# Altium project Senior_Project_PCB.PrjPcb
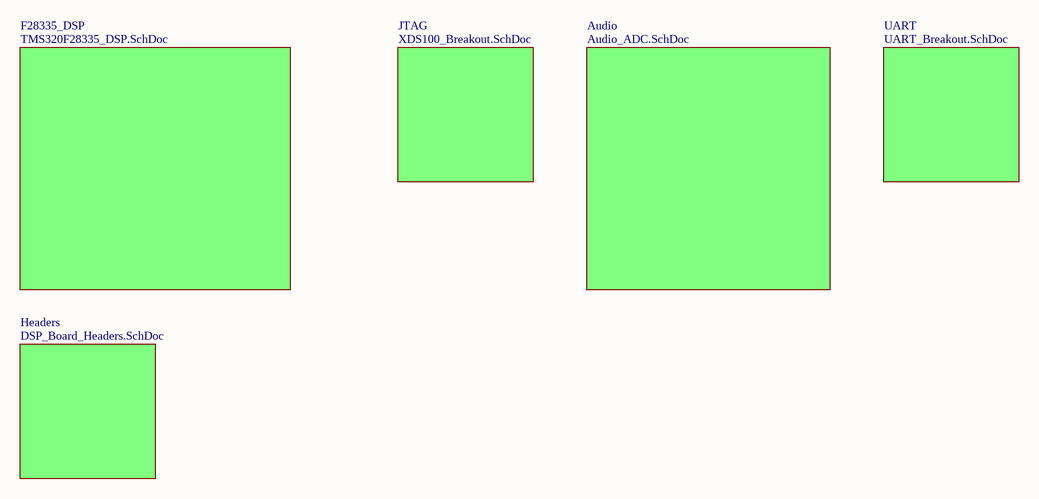
[diagram p0: DSP_Board.SchDoc]
5 sheets, 124 parts. Net scope: global (net labels, ports and power ports of the same name join across sheets).
Board file: DSP_Board.PcbDoc
Sheets:
  DSP_Board.SchDoc
    F28335_DSP = TMS320F28335_DSP.SchDoc
    Audio = Audio_ADC.SchDoc
    Headers = DSP_Board_Headers.SchDoc
  DSP_Power.SchDoc

## Sheet DSP_Board.SchDoc
size Letter

### Sub-sheets
Audio = Audio_ADC.SchDoc: no entries
F28335_DSP = TMS320F28335_DSP.SchDoc: no entries
Headers = DSP_Board_Headers.SchDoc: no entries
JTAG = XDS100_Breakout.SchDoc (file not in this document): no entries
UART = UART_Breakout.SchDoc (file not in this document): no entries

## Sheet TMS320F28335_DSP.SchDoc
size C
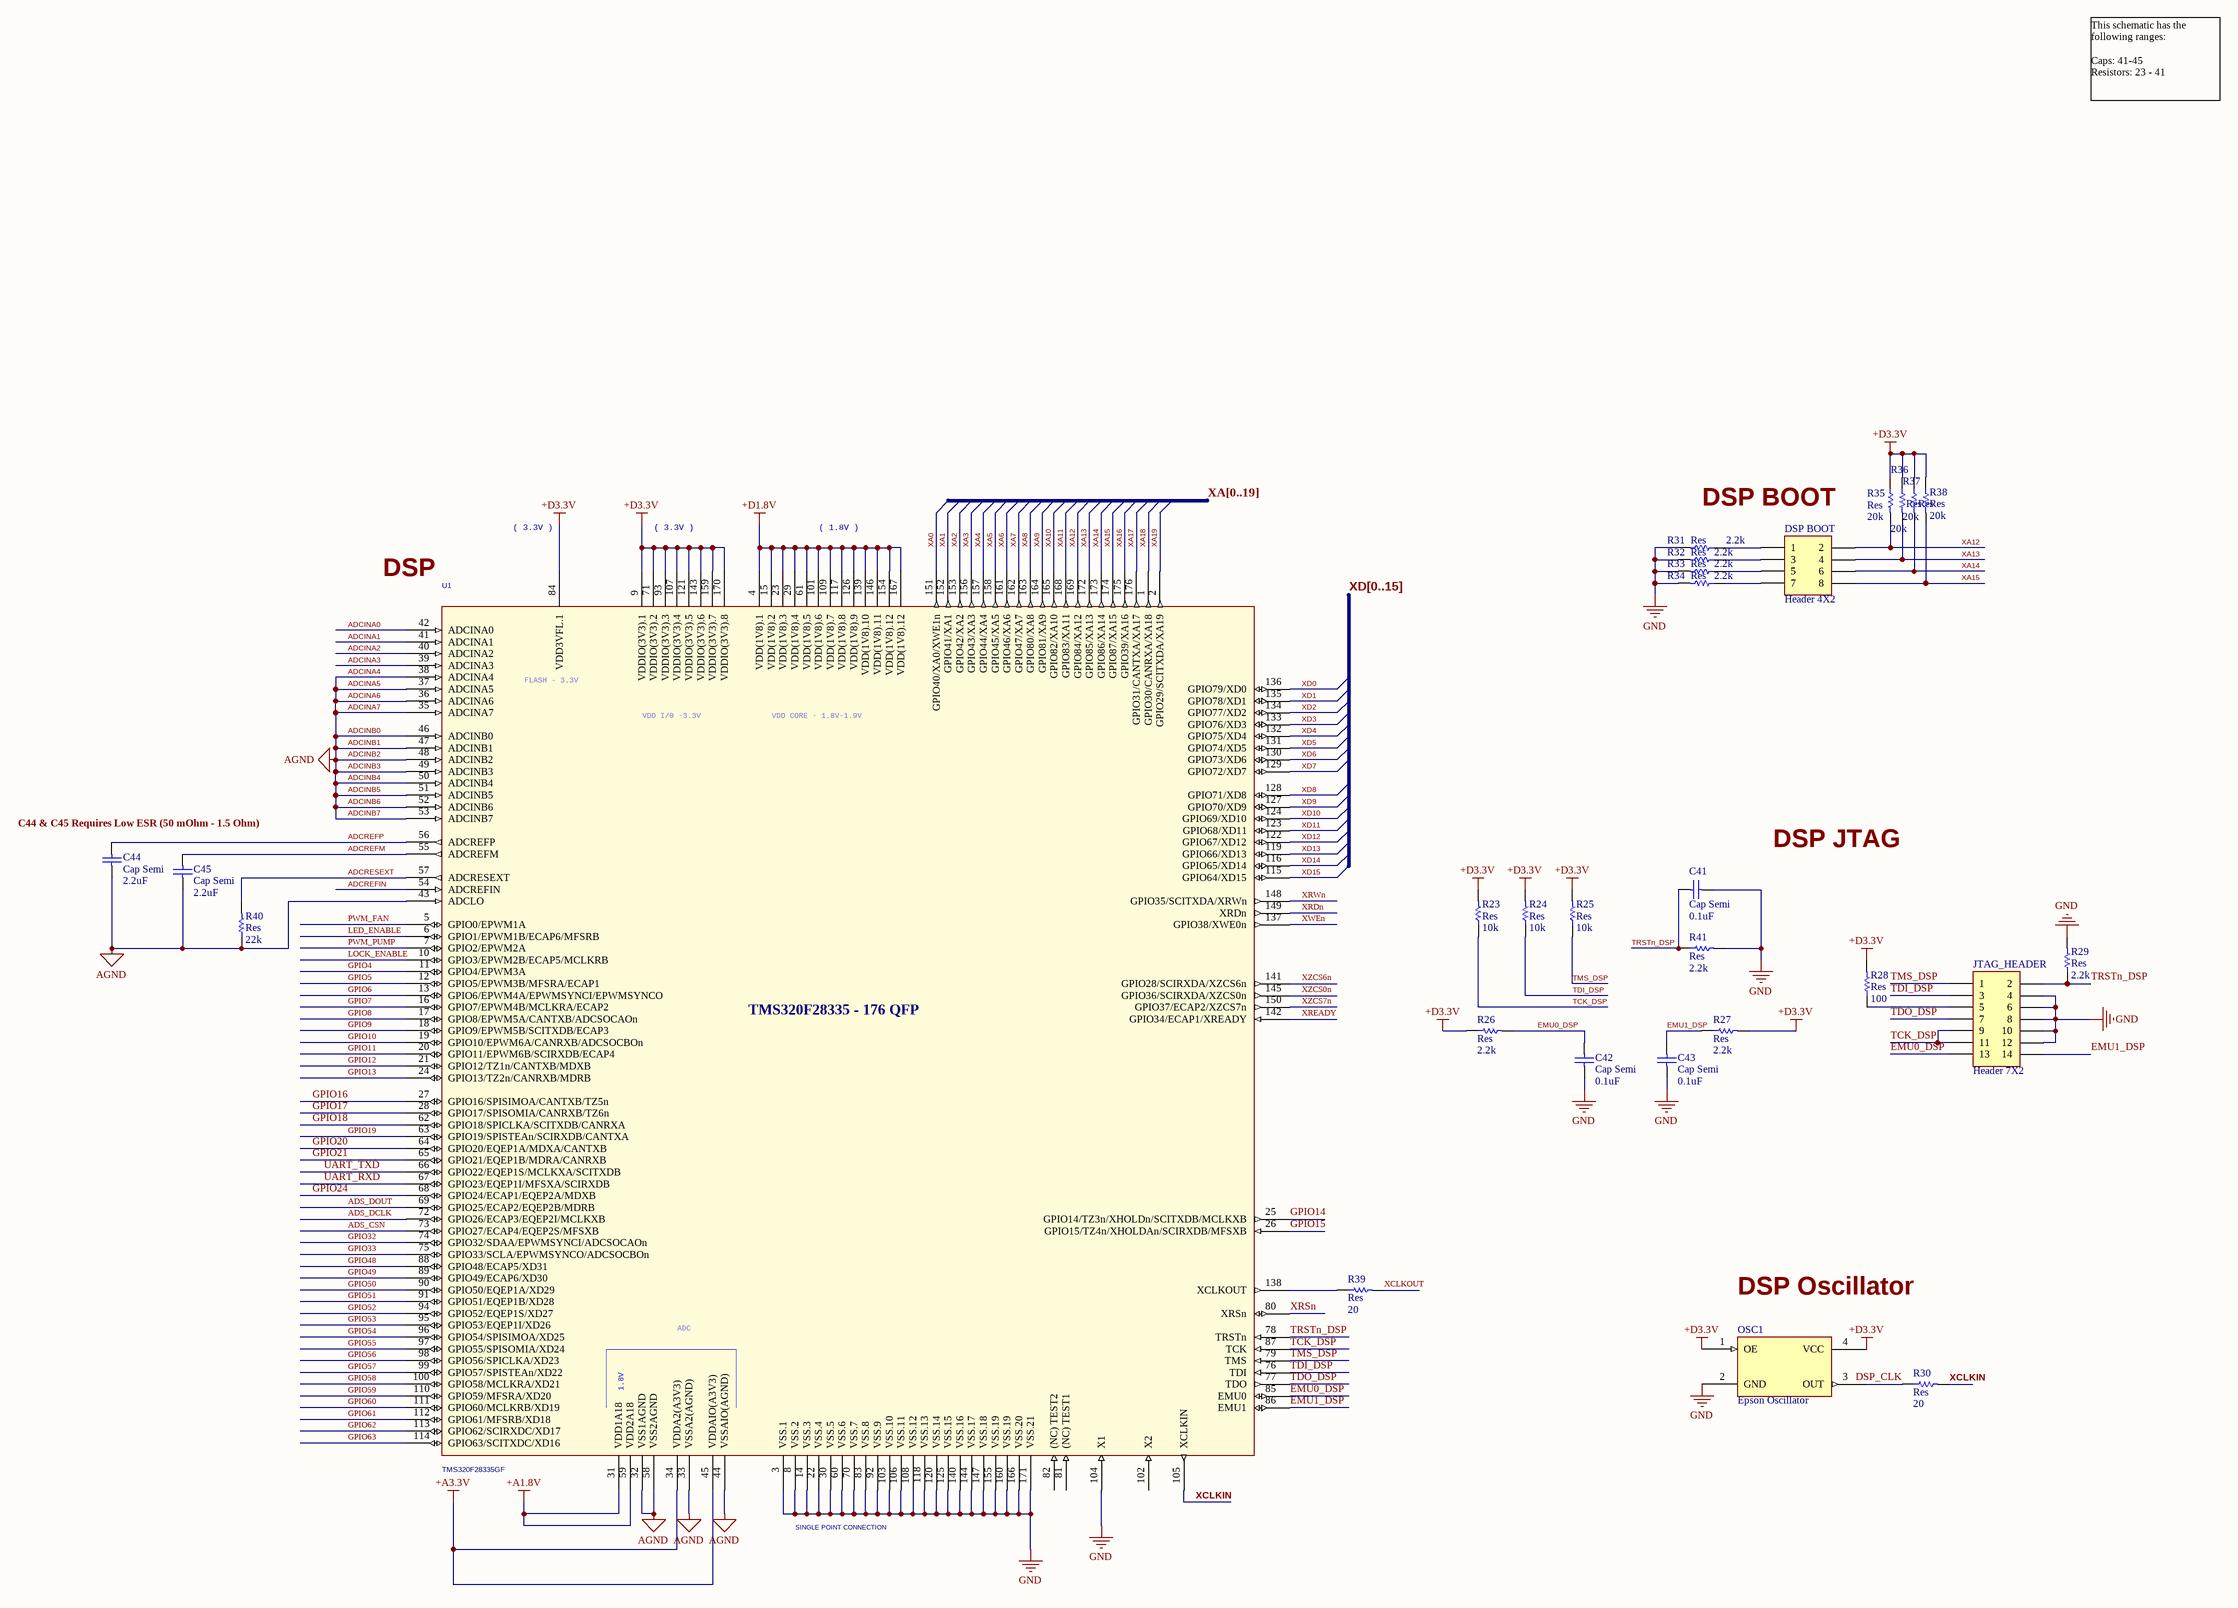
[diagram p1: TMS320F28335_DSP.SchDoc]

### Parts
C41  Cap Semi  value 0.1uF  [0805]
C42  Cap Semi  value 0.1uF  [0805]
C43  Cap Semi  value 0.1uF  [0805]
C44  Cap Semi  value 2.2uF  [0805]
C45  Cap Semi  value 2.2uF  [0805]
DSP_BOOT  Header 4X2  [HDR2X4]
JTAG_HEADER  Header 7X2  [HDR2X7]
OSC1  Epson Oscillator  [Oscillator]
R23  Res  value 10k  [0805]
R24  Res  value 10k  [0805]
R25  Res  value 10k  [0805]
R26  Res  value 2.2k  [0805]
R27  Res  value 2.2k  [0805]
R28  Res  value 100  [0805]
R29  Res  value 2.2k  [0805]
R30  Res  value 20  [0805]
R31  Res  value 2.2k  [0805]
R32  Res  value 2.2k  [0805]
R33  Res  value 2.2k  [0805]
R34  Res  value 2.2k  [0805]
R35  Res  value 20k  [0805]
R36  Res  value 20k  [0805]
R37  Res  value 20k  [0805]
R38  Res  value 20k  [0805]
R39  Res  value 20  [0805]
R40  Res  value 22k  [0805]
R41  Res  value 2.2k  [0805]
U1  TMS320F28335GF  [QFP176]

### Nets
+A1.8V: U1.31(VDD1A18) U1.59(VDD2A18)
+A3.3V: U1.34(VDDA2(A3V3)) U1.45(VDDAIO(A3V3))
+D1.8V: U1.4(VDD(1V8).1) U1.15(VDD(1V8).2) U1.23(VDD(1V8).3) U1.29(VDD(1V8).4) U1.61(VDD(1V8).5) U1.101(VDD(1V8).6) U1.109(VDD(1V8).7) U1.117(VDD(1V8).8) U1.126(VDD(1V8).9) U1.139(VDD(1V8).10) U1.146(VDD(1V8).11) U1.154(VDD(1V8).12) U1.167(VDD(1V8).12)
+D3.3V: OSC1.1(OE) OSC1.4(VCC) R23.2 R24.2 R25.2 R26.1 R27.2 R28.2 R35.1 R36.1 R37.1 R38.1 U1.9(VDDIO(3V3).1) U1.71(VDDIO(3V3).2) U1.84(VDD3VFL.1) U1.93(VDDIO(3V3).3) U1.107(VDDIO(3V3).4) U1.121(VDDIO(3V3).5) U1.143(VDDIO(3V3).6) U1.159(VDDIO(3V3).7) U1.170(VDDIO(3V3).8)
ADCINA4: C44.2 C45.2 R40.1 U1.32(VSS1AGND) U1.33(VSSA2(AGND)) U1.35(ADCINA7) U1.36(ADCINA6) U1.37(ADCINA5) U1.38(ADCINA4) U1.43(ADCLO) U1.44(VSSAIO(AGND)) U1.46(ADCINB0) U1.47(ADCINB1) U1.48(ADCINB2) U1.49(ADCINB3) U1.50(ADCINB4) U1.51(ADCINB5) U1.52(ADCINB6) U1.53(ADCINB7) U1.58(VSS2AGND)  [also labelled ADCINA5, ADCINA6, ADCINA7, ADCINB0, ADCINB1, ADCINB2, ADCINB3, ADCINB4, ADCINB5, ADCINB6, ADCINB7, AGND]
GND: C41.1 C42.1 C43.1 JTAG_HEADER.4 JTAG_HEADER.6 JTAG_HEADER.8 JTAG_HEADER.10 JTAG_HEADER.12 OSC1.2(GND) R29.2 R31.2 R32.2 R33.2 R34.2 R41.2 U1.3(VSS.1) U1.8(VSS.2) U1.14(VSS.3) U1.22(VSS.4) U1.30(VSS.5) U1.60(VSS.6) U1.70(VSS.7) U1.83(VSS.8) U1.92(VSS.9) U1.103(VSS.10) U1.104(X1) U1.106(VSS.11) U1.108(VSS.12) U1.118(VSS.13) U1.120(VSS.14) U1.125(VSS.15) U1.140(VSS.16) U1.144(VSS.17) U1.147(VSS.18) U1.155(VSS.19) U1.160(VSS.19) U1.166(VSS.20) U1.171(VSS.21)
ADCINA0: U1.42(ADCINA0)
ADCINA1: U1.41(ADCINA1)
ADCINA2: U1.40(ADCINA2)
ADCINA3: U1.39(ADCINA3)
ADCREFIN: U1.54(ADCREFIN)
ADCREFM: C45.1 U1.55(ADCREFM)
ADCREFP: C44.1 U1.56(ADCREFP)
ADCRESEXT: R40.2 U1.57(ADCRESEXT)
ADS_CSN: U1.73(GPIO27/ECAP4/EQEP2S/MFSXB)
ADS_DCLK: U1.72(GPIO26/ECAP3/EQEP2I/MCLKXB)
ADS_DOUT: U1.69(GPIO25/ECAP2/EQEP2B/MDRB)
EMU0_DSP: C42.2 JTAG_HEADER.13 R26.2 U1.85(EMU0)
EMU1_DSP: C43.2 JTAG_HEADER.14 R27.1 U1.86(EMU1)
GPIO4: U1.11(GPIO4/EPWM3A)
GPIO5: U1.12(GPIO5/EPWM3B/MFSRA/ECAP1)
GPIO6: U1.13(GPIO6/EPWM4A/EPWMSYNCI/EPWMSYNCO)
GPIO7: U1.16(GPIO7/EPWM4B/MCLKRA/ECAP2)
GPIO8: U1.17(GPIO8/EPWM5A/CANTXB/ADCSOCAOn)
GPIO9: U1.18(GPIO9/EPWM5B/SCITXDB/ECAP3)
GPIO10: U1.19(GPIO10/EPWM6A/CANRXB/ADCSOCBOn)
GPIO11: U1.20(GPIO11/EPWM6B/SCIRXDB/ECAP4)
GPIO12: U1.21(GPIO12/TZ1n/CANTXB/MDXB)
GPIO13: U1.24(GPIO13/TZ2n/CANRXB/MDRB)
GPIO14: U1.25(GPIO14/TZ3n/XHOLDn/SCITXDB/MCLKXB)
GPIO15: U1.26(GPIO15/TZ4n/XHOLDAn/SCIRXDB/MFSXB)
GPIO16: U1.27(GPIO16/SPISIMOA/CANTXB/TZ5n)
GPIO17: U1.28(GPIO17/SPISOMIA/CANRXB/TZ6n)
GPIO18: U1.62(GPIO18/SPICLKA/SCITXDB/CANRXA)
GPIO19: U1.63(GPIO19/SPISTEAn/SCIRXDB/CANTXA)
GPIO20: U1.64(GPIO20/EQEP1A/MDXA/CANTXB)
GPIO21: U1.65(GPIO21/EQEP1B/MDRA/CANRXB)
GPIO24: U1.68(GPIO24/ECAP1/EQEP2A/MDXB)
GPIO32: U1.74(GPIO32/SDAA/EPWMSYNCI/ADCSOCAOn)
GPIO33: U1.75(GPIO33/SCLA/EPWMSYNCO/ADCSOCBOn)
GPIO48: U1.88(GPIO48/ECAP5/XD31)
GPIO49: U1.89(GPIO49/ECAP6/XD30)
GPIO50: U1.90(GPIO50/EQEP1A/XD29)
GPIO51: U1.91(GPIO51/EQEP1B/XD28)
GPIO52: U1.94(GPIO52/EQEP1S/XD27)
GPIO53: U1.95(GPIO53/EQEP1I/XD26)
GPIO54: U1.96(GPIO54/SPISIMOA/XD25)
GPIO55: U1.97(GPIO55/SPISOMIA/XD24)
GPIO56: U1.98(GPIO56/SPICLKA/XD23)
GPIO57: U1.99(GPIO57/SPISTEAn/XD22)
GPIO58: U1.100(GPIO58/MCLKRA/XD21)
GPIO59: U1.110(GPIO59/MFSRA/XD20)
GPIO60: U1.111(GPIO60/MCLKRB/XD19)
GPIO61: U1.112(GPIO61/MFSRB/XD18)
GPIO62: U1.113(GPIO62/SCIRXDC/XD17)
GPIO63: U1.114(GPIO63/SCITXDC/XD16)
LED_ENABLE: U1.6(GPIO1/EPWM1B/ECAP6/MFSRB)
LOCK_ENABLE: U1.10(GPIO3/EPWM2B/ECAP5/MCLKRB)
PWM_FAN: U1.5(GPIO0/EPWM1A)
PWM_PUMP: U1.7(GPIO2/EPWM2A)
TCK_DSP: JTAG_HEADER.9 JTAG_HEADER.11 R23.1 U1.87(TCK)
TDI_DSP: JTAG_HEADER.3 R24.1 U1.76(TDI)
TDO_DSP: JTAG_HEADER.7 U1.77(TDO)
TMS_DSP: JTAG_HEADER.1 R25.1 U1.79(TMS)
TRSTn_DSP: C41.2 JTAG_HEADER.2 R29.1 R41.1 U1.78(TRSTn)
UART_RXD: U1.67(GPIO23/EQEP1I/MFSXA/SCIRXDB)
UART_TXD: U1.66(GPIO22/EQEP1S/MCLKXA/SCITXDB)
XA0: U1.151(GPIO40/XA0/XWE1n)
XA1: U1.152(GPIO41/XA1)
XA2: U1.153(GPIO42/XA2)
XA3: U1.156(GPIO43/XA3)
XA4: U1.157(GPIO44/XA4)
XA5: U1.158(GPIO45/XA5)
XA6: U1.161(GPIO46/XA6)
XA7: U1.162(GPIO47/XA7)
XA8: U1.163(GPIO80/XA8)
XA9: U1.164(GPIO81/XA9)
XA10: U1.165(GPIO82/XA10)
XA11: U1.168(GPIO83/XA11)
XA12: DSP_BOOT.2 R35.2 U1.169(GPIO84/XA12)
XA13: DSP_BOOT.4 R36.2 U1.172(GPIO85/XA13)
XA14: DSP_BOOT.6 R37.2 U1.173(GPIO86/XA14)
XA15: DSP_BOOT.8 R38.2 U1.174(GPIO87/XA15)
XA16: U1.175(GPIO39/XA16)
XA17: U1.176(GPIO31/CANTXA/XA17)
XA18: U1.1(GPIO30/CANRXA/XA18)
XA19: U1.2(GPIO29/SCITXDA/XA19)
XCLKIN: R30.2 U1.105(XCLKIN)
XCLKOUT: R39.2
XD0: U1.136(GPIO79/XD0)
XD1: U1.135(GPIO78/XD1)
XD2: U1.134(GPIO77/XD2)
XD3: U1.133(GPIO76/XD3)
XD4: U1.132(GPIO75/XD4)
XD5: U1.131(GPIO74/XD5)
XD6: U1.130(GPIO73/XD6)
XD7: U1.129(GPIO72/XD7)
XD8: U1.128(GPIO71/XD8)
XD9: U1.127(GPIO70/XD9)
XD10: U1.124(GPIO69/XD10)
XD11: U1.123(GPIO68/XD11)
XD12: U1.122(GPIO67/XD12)
XD13: U1.119(GPIO66/XD13)
XD14: U1.116(GPIO65/XD14)
XD15: U1.115(GPIO64/XD15)
XRDn: U1.149(XRDn)
XREADY: U1.142(GPIO34/ECAP1/XREADY)
XRSn: U1.80(XRSn)
XRWn: U1.148(GPIO35/SCITXDA/XRWn)
XWEn: U1.137(GPIO38/XWE0n)
XZCS0n: U1.145(GPIO36/SCIRXDA/XZCS0n)
XZCS6n: U1.141(GPIO28/SCIRXDA/XZCS6n)
XZCS7n: U1.150(GPIO37/ECAP2/XZCS7n)
NetDSP_BOOT_1: DSP_BOOT.1 R31.1
NetDSP_BOOT_3: DSP_BOOT.3 R32.1
NetDSP_BOOT_5: DSP_BOOT.5 R33.1
NetDSP_BOOT_7: DSP_BOOT.7 R34.1
NetJTAG_HEADER_5: JTAG_HEADER.5 R28.1
NetOSC1_3: OSC1.3(OUT) R30.1
NetR39_1: R39.1 U1.138(XCLKOUT)

Not connected (* = marked no-connect by the designer): U1 81((NC)_TEST1) 82((NC)_TEST2) 102(X2)

### Buses and harness runs
bus XA[0..19]
bus XD[0..15]

### Notes on the sheet
- This schematic has the following ranges:
  Caps: 41-45
  Resistors: 23 - 41
- ( 3.3V )
- ( 1.8V )
- DSP BOOT
- (near U1) DSP
- C44 & C45 Requires Low ESR (50 mOhm - 1.5 Ohm)
- DSP JTAG
- DSP Oscillator
- SINGLE POINT CONNECTION
- Labels drawn without touching a wire or pin: DSP_CLK
- (in symbol TMS320F283XXPGF_23) FLASH - 3.3V; VDD I/0 -3.3V; VDD CORE - 1.8V-1.9V; TMS320F28335 - 176 QFP; ADC; 1.8V

### Library data of the parts
C41-C45 = Cap Semi: Capacitor (Semiconductor SIM Model); Published: 8-Jun-2000; LatestRevisionDate: 17-Jul-2002; LatestRevisionNote: Re-released for DXP Platform.; PackageReference: C1206; Publisher: Altium Limited
DSP_BOOT = Header 4X2: Header, 4-Pin, Dual row; LatestRevisionDate: 17-Jul-2002; LatestRevisionNote: Re-released for DXP Platform.; Publisher: Altium Limited
JTAG_HEADER = Header 7X2: Header, 7-Pin, Dual row; LatestRevisionDate: 17-Jul-2002; LatestRevisionNote: Re-released for DXP Platform.; Publisher: Altium Limited
OSC1 = Oscillator: 15Mhz Epson Clock; Digikey #: SE2826CT-ND
R23-R41 = Res Semi: Semiconductor Resistor; Published: 8-Jun-2000; LatestRevisionDate: 17-Jul-2002; LatestRevisionNote: Re-released for DXP Platform.; PackageReference: AXIAL-0.5; Publisher: Altium Limited
U1 = TMS320F283XXPGF_23: Texas Instruments F28335; Digikey #: 296-23660-ND

## Sheet Audio_ADC.SchDoc
size Letter
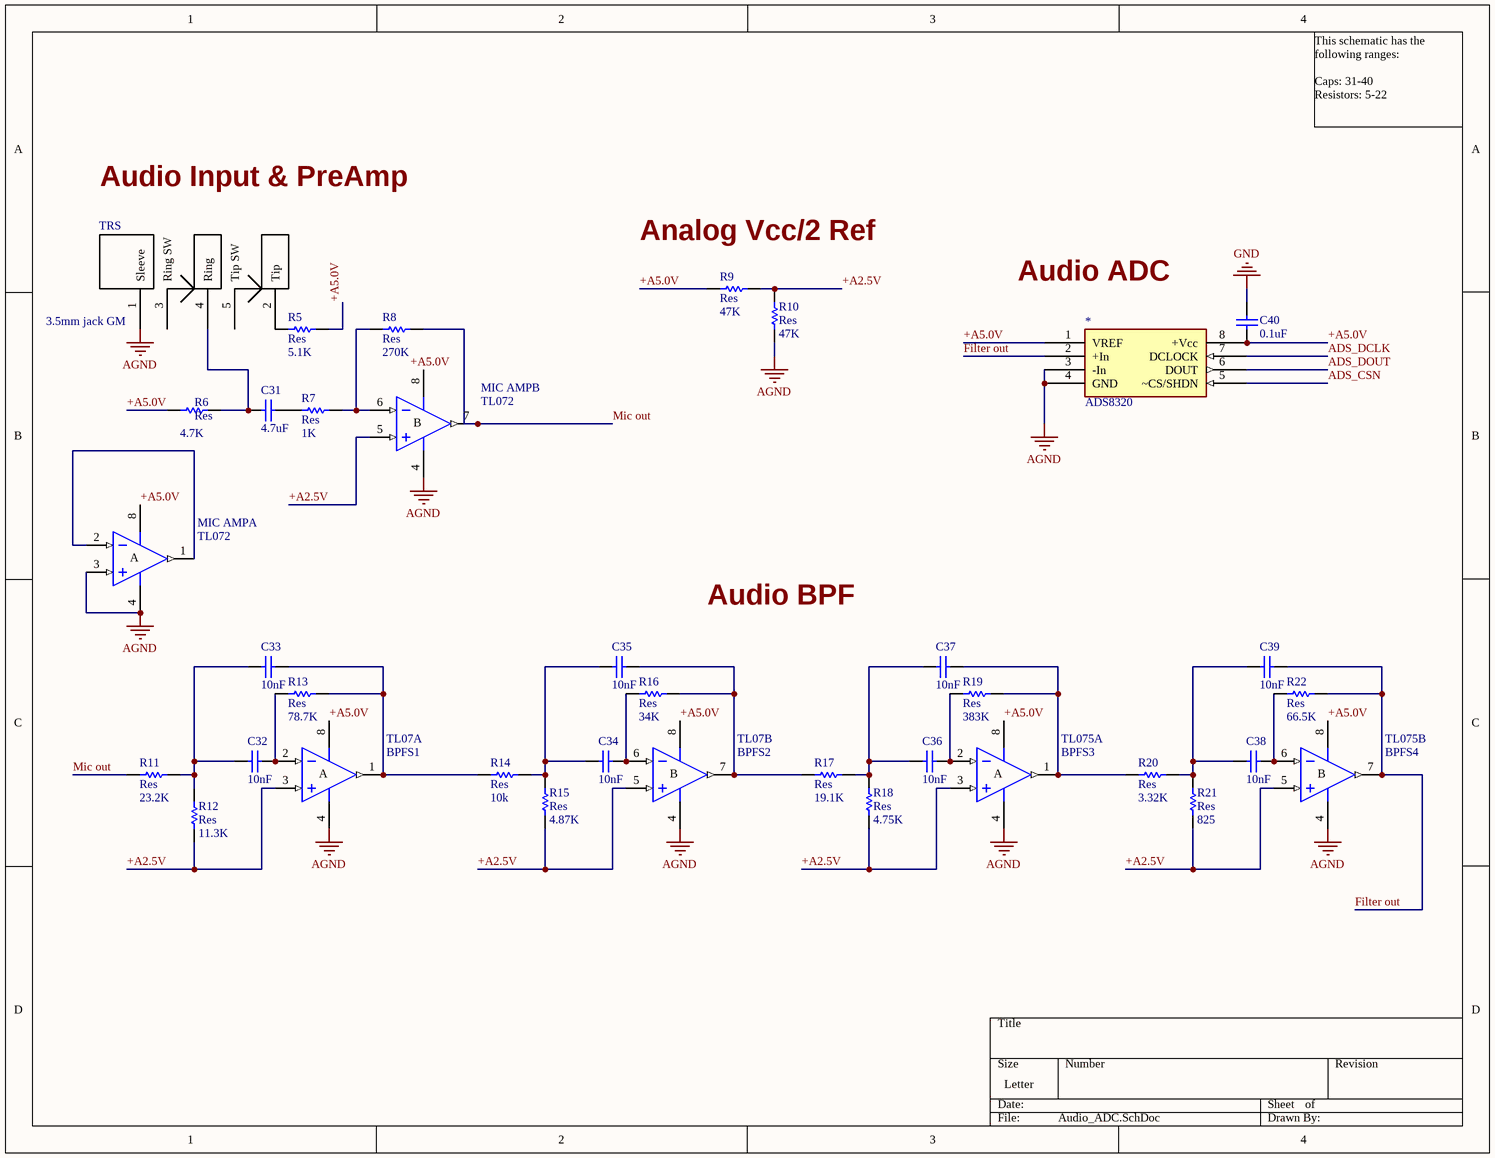
[diagram p2: Audio_ADC.SchDoc]

### Parts
*  ADS8320  [TSOP65P490X110-8N]
C31  value 4.7uF  [0805]  (hidden comment: Cap Semi)
C32  value 10nF  [0805]  (hidden comment: Cap Semi)
C33  value 10nF  [0805]  (hidden comment: Cap Semi)
C34  value 10nF  [0805]  (hidden comment: Cap Semi)
C35  value 10nF  [0805]  (hidden comment: Cap Semi)
C36  value 10nF  [0805]  (hidden comment: Cap Semi)
C37  value 10nF  [0805]  (hidden comment: Cap Semi)
C38  value 10nF  [0805]  (hidden comment: Cap Semi)
C39  value 10nF  [0805]  (hidden comment: Cap Semi)
C40  value 0.1uF  [0805]  (hidden comment: Cap Semi)
MIC_AMP  TL072  [DIP-8]  (parts A,B of 2)
R5  Res  value 5.1K  [0805]
R6  Res  value 4.7K  [0805]
R7  Res  value 1K  [0805]
R8  Res  value 270K  [0805]
R9  Res  value 47K  [0805]
R10  Res  value 47K  [0805]
R11  Res  value 23.2K  [0805]
R12  Res  value 11.3K  [0805]
R13  Res  value 78.7K  [0805]
R14  Res  value 10k  [0805]
R15  Res  value 4.87K  [0805]
R16  Res  value 34K  [0805]
R17  Res  value 19.1K  [0805]
R18  Res  value 4.75K  [0805]
R19  Res  value 383K  [0805]
R20  Res  value 3.32K  [0805]
R21  Res  value 825  [0805]
R22  Res  value 66.5K  [0805]
TL07  BPFS1  [DIP-8]  (parts A,B of 2)
TL075  BPFS3  [DIP-8]  (parts A,B of 2)
TRS  3.5mm jack GM  [3.5mm jack GM]

### Nets
+A5.0V: *.1(VREF) *.8(+Vcc) C40.1 MIC_AMP.8(V+) R5.1 R6.2 R9.2 TL07.8(V+) TL075.8(V+)
AGND: *.3(-In) *.4(GND) MIC_AMP.3(IN+) MIC_AMP.4(V-) R10.1 TL07.4(V-) TL075.4(V-) TRS.1(Sleeve)  [project net ADCINA4]
GND: C40.2
+A2.5V: MIC_AMP.5(IN+) R9.1 R10.2 R12.2 R15.1 R18.1 R21.1 TL07.3(IN+) TL07.5(IN+) TL075.3(IN+) TL075.5(IN+)
ADS_CSN: *.5(~CS/SHDN)
ADS_DCLK: *.7(DCLOCK)
ADS_DOUT: *.6(DOUT)
Filter out: *.2(+In) C39.2 R22.1 TL075.7(OUT)
Mic out: MIC_AMP.7(OUT) R8.1 R11.2
NetC31_1: C31.1 R6.1 TRS.4(Ring)
NetC31_2: C31.2 R7.2
NetC32_1: C32.1 C33.1 R11.1 R12.1
NetC32_2: C32.2 R13.2 TL07.2(IN-)
NetC33_2: C33.2 R13.1 R14.2 TL07.1(OUT)
NetC34_1: C34.1 C35.1 R14.1 R15.2
NetC34_2: C34.2 R16.2 TL07.6(IN-)
NetC35_2: C35.2 R16.1 R17.2 TL07.7(OUT)
NetC36_1: C36.1 C37.1 R17.1 R18.2
NetC36_2: C36.2 R19.2 TL075.2(IN-)
NetC37_2: C37.2 R19.1 R20.2 TL075.1(OUT)
NetC38_1: C38.1 C39.1 R20.1 R21.2
NetC38_2: C38.2 R22.2 TL075.6(IN-)
NetMIC_AMP_1: MIC_AMP.1(OUT) MIC_AMP.2(IN-)
NetMIC_AMP_6: MIC_AMP.6(IN-) R7.1 R8.2
NetR5_2: R5.2 TRS.2(Tip)

Not connected (* = marked no-connect by the designer): TRS 3(Ring_SW) 5(Tip_SW)

### Notes on the sheet
- This schematic has the following ranges:
  Caps: 31-40
  Resistors: 5-22
- Audio Input & PreAmp
- Analog Vcc/2 Ref
- Audio ADC
- Audio BPF
- Labels drawn without touching a wire or pin: +A5.0V
- (in symbol LT1632CN8, part A) A
- (in symbol LT1632CN8, part B) B

### Library data of the parts
C31-C40 = Cap Semi: Capacitor (Semiconductor SIM Model); Published: 8-Jun-2000; LatestRevisionDate: 17-Jul-2002; LatestRevisionNote: Re-released for DXP Platform.; PackageReference: C1206; Publisher: Altium Limited
MIC_AMP TL07 TL075 = LT1632CN8: 45MHz, 45V/µs, Dual Rail-to-Rail Input and Output Precision Operational Amplifier; Note: 1455; Published: 8-Jun-2000; LatestRevisionDate: 29-May-2009; LatestRevisionNote: Component Body Added.; DatasheetVersion: 1996; PackageVersion: N8 1002; PackageReference: N8; Publisher: Altium Limited; PackageDescription: DIP, Plastic, 8-Pin, Row Spacing 7.62 mm, Pitch 2.54 mm; ComponentLink1Description: Manufacturer Link; ComponentLink1URL: http://www.linear.com/; ComponentLink2Description: Datasheet; ComponentLink2URL: http://www.linear.com/pc/downloadDocument.do?navId=H0,C1,C1154,C1009,C1022,P1642,D3055
R5-R22 = Res Semi: Semiconductor Resistor; Published: 8-Jun-2000; LatestRevisionDate: 17-Jul-2002; LatestRevisionNote: Re-released for DXP Platform.; PackageReference: AXIAL-0.5; Publisher: Altium Limited

## Sheet DSP_Board_Headers.SchDoc
size Letter
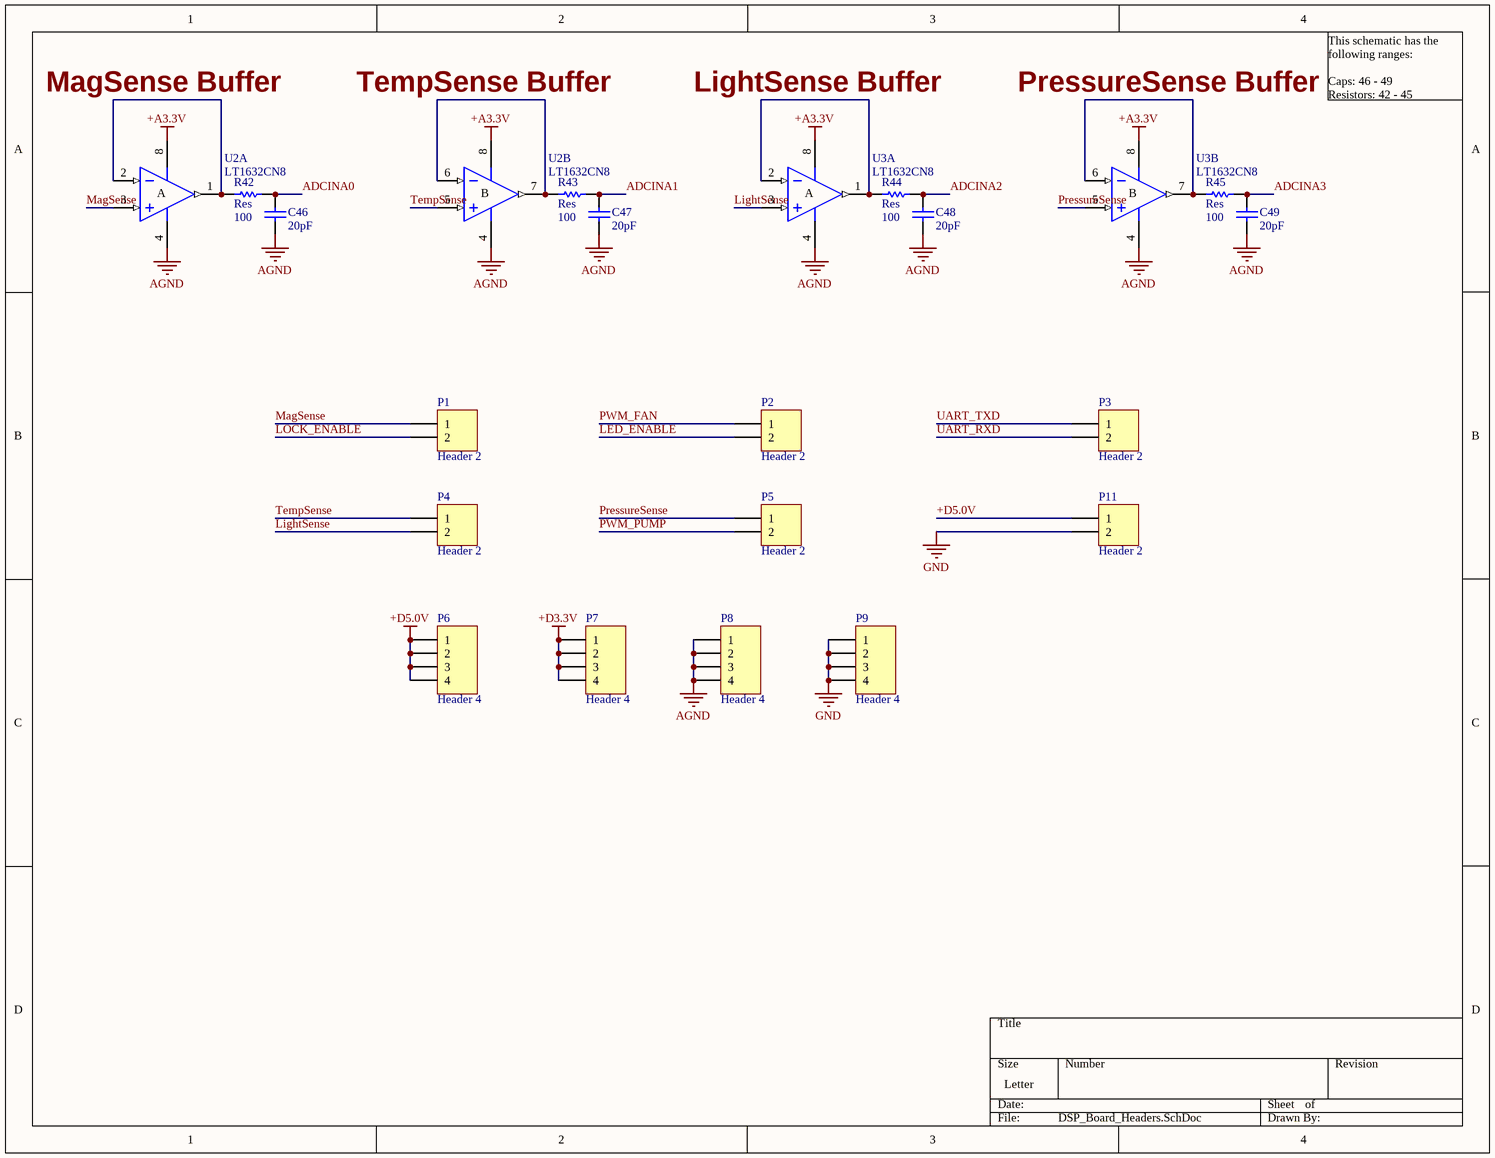
[diagram p3: DSP_Board_Headers.SchDoc]

### Parts
C46  value 20pF  [0805]  (hidden comment: Cap Semi)
C47  value 20pF  [0805]  (hidden comment: Cap Semi)
C48  value 20pF  [0805]  (hidden comment: Cap Semi)
C49  value 20pF  [0805]  (hidden comment: Cap Semi)
P1  Header 2  [HDR1X2]
P2  Header 2  [HDR1X2]
P3  Header 2  [HDR1X2]
P4  Header 2  [HDR1X2]
P5  Header 2  [HDR1X2]
P6  Header 4  [HDR1X4]
P7  Header 4  [HDR1X4]
P8  Header 4  [HDR1X4]
P9  Header 4  [HDR1X4]
P11  Header 2  [HDR1X2]
R42  Res  value 100  [0805]
R43  Res  value 100  [0805]
R44  Res  value 100  [0805]
R45  Res  value 100  [0805]
U2  LT1632CN8  [DIP-8]  (parts A,B of 2)
U3  LT1632CN8  [DIP-8]  (parts A,B of 2)

### Nets
+A3.3V: U2.8(V+) U3.8(V+)
+D3.3V: P7.1 P7.2 P7.3 P7.4
+D5.0V: P6.1 P6.2 P6.3 P6.4 P11.1
AGND: C46.1 C47.1 C48.1 C49.1 P8.1 P8.2 P8.3 P8.4 U2.4(V-) U3.4(V-)  [project net ADCINA4]
GND: P9.1 P9.2 P9.3 P9.4 P11.2
ADCINA0: C46.2 R42.2
ADCINA1: C47.2 R43.2
ADCINA2: C48.2 R44.2
ADCINA3: C49.2 R45.2
LED_ENABLE: P2.2
LightSense: P4.2 U3.3(IN+)
LOCK_ENABLE: P1.2
MagSense: P1.1 U2.3(IN+)
PressureSense: P5.1 U3.5(IN+)
PWM_FAN: P2.1
PWM_PUMP: P5.2
TempSense: P4.1 U2.5(IN+)
UART_RXD: P3.2
UART_TXD: P3.1
NetR42_1: R42.1 U2.1(OUT) U2.2(IN-)
NetR43_1: R43.1 U2.6(IN-) U2.7(OUT)
NetR44_1: R44.1 U3.1(OUT) U3.2(IN-)
NetR45_1: R45.1 U3.6(IN-) U3.7(OUT)

### Notes on the sheet
- MagSense Buffer
- TempSense Buffer
- LightSense Buffer
- PressureSense Buffer
- This schematic has the following ranges:
  Caps: 46 - 49
  Resistors: 42 - 45
- (in symbol LT1632CN8, part A) A
- (in symbol LT1632CN8, part B) B

### Library data of the parts
C46-C49 = Cap Semi: Capacitor (Semiconductor SIM Model); Published: 8-Jun-2000; LatestRevisionDate: 17-Jul-2002; LatestRevisionNote: Re-released for DXP Platform.; PackageReference: C1206; Publisher: Altium Limited
P1-P5 P11 = Header 2: Header, 2-Pin; LatestRevisionDate: 17-Jul-2002; LatestRevisionNote: Re-released for DXP Platform.; Publisher: Altium Limited
P6-P9 = Header 4: Header, 4-Pin; LatestRevisionDate: 17-Jul-2002; LatestRevisionNote: Re-released for DXP Platform.; Publisher: Altium Limited
R42-R45 = Res Semi: Semiconductor Resistor; Published: 8-Jun-2000; LatestRevisionDate: 17-Jul-2002; LatestRevisionNote: Re-released for DXP Platform.; PackageReference: AXIAL-0.5; Publisher: Altium Limited
U2 U3 = LT1632CN8: as MIC_AMP on sheet Audio_ADC; Published: 8-Jun-2000; LatestRevisionDate: 29-May-2009; LatestRevisionNote: Component Body Added.; DatasheetVersion: 1996; PackageVersion: N8 1002; PackageReference: N8; Publisher: Altium Limited; PackageDescription: DIP, Plastic, 8-Pin, Row Spacing 7.62 mm, Pitch 2.54 mm; ComponentLink1Description: Manufacturer Link; ComponentLink1URL: http://www.linear.com/; ComponentLink2Description: Datasheet; ComponentLink2URL: http://www.linear.com/pc/downloadDocument.do?navId=H0,C1,C1154,C1009,C1022,P1642,D3055

## Sheet DSP_Power.SchDoc
size Letter
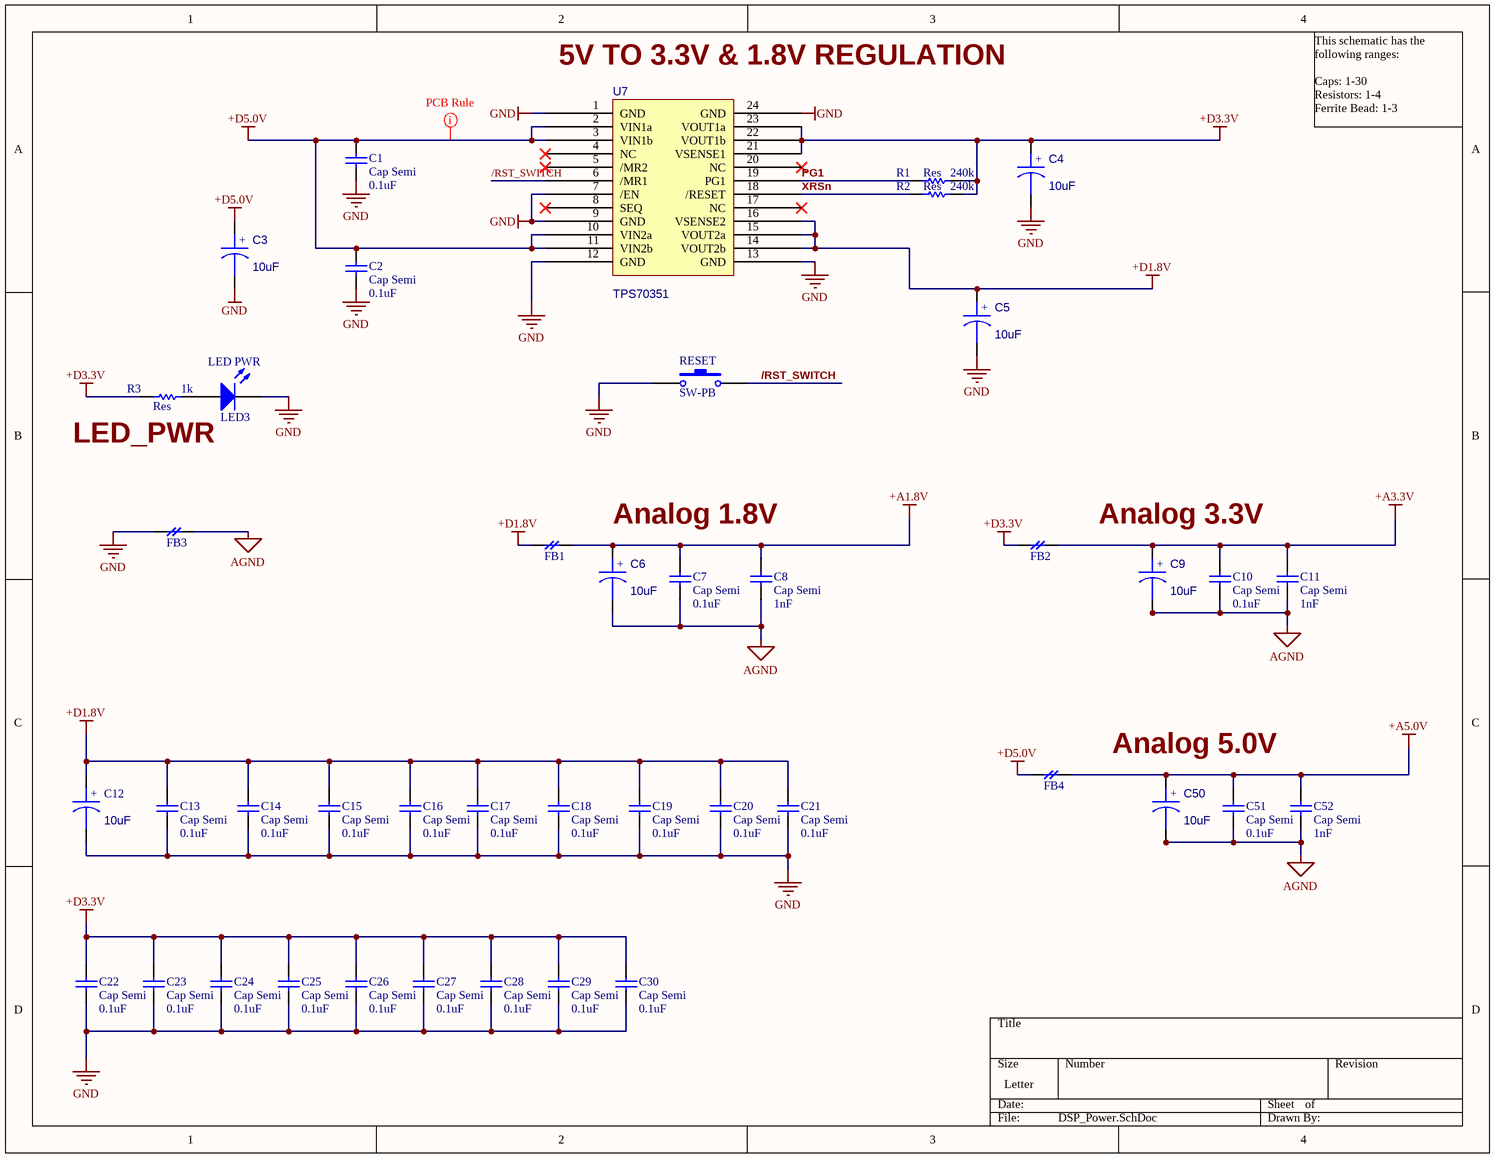
[diagram p4: DSP_Power.SchDoc]

### Parts
C1  Cap Semi  value 0.1uF  [0805]
C2  Cap Semi  value 0.1uF  [0805]
C3  10uF  [3528]
C4  10uF  [3528]
C5  10uF  [3528]
C6  10uF  [3528]
C7  Cap Semi  value 0.1uF  [0805]
C8  Cap Semi  value 1nF  [0805]
C9  10uF  [3528]
C10  Cap Semi  value 0.1uF  [0805]
C11  Cap Semi  value 1nF  [0805]
C12  10uF  [3528]
C13  Cap Semi  value 0.1uF  [0805]
C14  Cap Semi  value 0.1uF  [0805]
C15  Cap Semi  value 0.1uF  [0805]
C16  Cap Semi  value 0.1uF  [0805]
C17  Cap Semi  value 0.1uF  [0805]
C18  Cap Semi  value 0.1uF  [0805]
C19  Cap Semi  value 0.1uF  [0805]
C20  Cap Semi  value 0.1uF  [0805]
C21  Cap Semi  value 0.1uF  [0805]
C22  Cap Semi  value 0.1uF  [0805]
C23  Cap Semi  value 0.1uF  [0805]
C24  Cap Semi  value 0.1uF  [0805]
C25  Cap Semi  value 0.1uF  [0805]
C26  Cap Semi  value 0.1uF  [0805]
C27  Cap Semi  value 0.1uF  [0805]
C28  Cap Semi  value 0.1uF  [0805]
C29  Cap Semi  value 0.1uF  [0805]
C30  Cap Semi  value 0.1uF  [0805]
C50  10uF  [3528]
C51  Cap Semi  value 0.1uF  [0805]
C52  Cap Semi  value 1nF  [0805]
FB1  Ferrite_Bead  [CR2012-0805]  (value not drawn)
FB2  Ferrite_Bead  [CR2012-0805]  (value not drawn)
FB3  Ferrite_Bead  [CR2012-0805]  (value not drawn)
FB4  Ferrite_Bead  [CR2012-0805]  (value not drawn)
LED_PWR  LED3  [0805]
R1  Res  value 240k  [0805]
R2  Res  value 240k  [0805]
R3  Res  value 1k  [0805]
RESET  SW-PB  [SWITCH_2PAD_SMD]
U7  TPS70351  [PWP24]

### Nets
+A1.8V: C6.1 C7.2 C8.2 FB1.2
+A3.3V: C9.1 C10.2 C11.2 FB2.2
+A5.0V: C50.1 C51.2 C52.2 FB4.2
+D1.8V: C5.1 C12.1 C13.2 C14.2 C15.2 C16.2 C17.2 C18.2 C19.2 C20.2 C21.2 FB1.1 U7.14(VOUT2b) U7.15(VOUT2a) U7.16(VSENSE2)
+D3.3V: C4.1 C22.2 C23.2 C24.2 C25.2 C26.2 C27.2 C28.2 C29.2 C30.2 FB2.1 R1.2 R2.2 R3.1 U7.21(VSENSE1) U7.22(VOUT1b) U7.23(VOUT1a)
+D5.0V: C1.2 C2.2 C3.1 FB4.1 U7.2(VIN1a) U7.3(VIN1b) U7.10(VIN2a) U7.11(VIN2b)
AGND: C6.2 C7.1 C8.1 C9.2 C10.1 C11.1 C50.2 C51.1 C52.1 FB3.2  [project net ADCINA4]
GND: C1.1 C2.1 C3.2 C4.2 C5.2 C12.2 C13.1 C14.1 C15.1 C16.1 C17.1 C18.1 C19.1 C20.1 C21.1 C22.1 C23.1 C24.1 C25.1 C26.1 C27.1 C28.1 C29.1 C30.1 FB3.1 LED_PWR.2(K) RESET.1 U7.1(GND) U7.7(/EN) U7.9(GND) U7.12(GND) U7.13(GND) U7.24(GND)
/RST_SWITCH: RESET.2 U7.6(/MR1)
PG1: R1.1 U7.19(PG1)
XRSn: R2.1 U7.18(/RESET)
NetLED_PWR_1: LED_PWR.1(A) R3.2

Not connected (* = marked no-connect by the designer): U7 4(NC)* 5(/MR2)* 8(SEQ)* 17(NC)* 20(NC)*

### Layout directives
rule Width Constraint [Pref Width = 11mil    Min Width = 11mil    Max Width = 15mil]: +D5.0V

### Notes on the sheet
- (near U7) 5V TO 3.3V & 1.8V REGULATION
- This schematic has the following ranges:
  Caps: 1-30
  Resistors: 1-4
  Ferrite Bead: 1-3
- (near R3) LED_PWR
- Analog 1.8V
- Analog 3.3V
- Analog 5.0V
- (in symbol CAPACITOR POL) +

### Library data of the parts
C1 C2 C7 C8 C10 C11 C13-C30 C51 C52 = Cap Semi: Capacitor (Semiconductor SIM Model); Published: 8-Jun-2000; LatestRevisionDate: 17-Jul-2002; LatestRevisionNote: Re-released for DXP Platform.; PackageReference: C1206; Publisher: Altium Limited
C3 = CAPACITOR POL: digi-399-1563-1-ND
C4 C6 C9 C50 = CAPACITOR POL: digi-399-3096-1-ND
C5 C12 = CAPACITOR POL: digi-399-1576-1-ND
FB1-FB4 = Ferrite_Bead: Ferrite Bead; Digikey #: 445-1554-1-ND
LED_PWR = LED3: Typical BLUE SiC LED; Published: 8-Jun-2000; LatestRevisionDate: 17-Dec-2003; LatestRevisionNote: PCB Footprint replaced.; DatasheetDocument: 16-Apr-2002; PackageDocument: 16-Apr-2002; PackageReference: 3.5X2.8X1.9; Publisher: Altium Limited
R1-R3 = Res Semi: Semiconductor Resistor; Published: 8-Jun-2000; LatestRevisionDate: 17-Jul-2002; LatestRevisionNote: Re-released for DXP Platform.; PackageReference: AXIAL-0.5; Publisher: Altium Limited
RESET = SW-PB: Switch; Published: 24-Mar-1999; LatestRevisionDate: 17-Jul-2002; LatestRevisionNote: Re-released for DXP Platform.; PackageReference: SPST-2; Publisher: Altium Limited; Digikey #: CKN9119CT-ND
U7 = TPS70351: IC 3.3V/1.8V LDO REG 24-HTSSOP; Digikey #: 296-8024-5-ND

## Nets that join several sheets
+A1.8V: TMS320F28335_DSP (U1.31 U1.59), DSP_Power (C6.1 C7.2 C8.2 FB1.2)
+A3.3V: TMS320F28335_DSP (U1.34 U1.45), DSP_Board_Headers (U2.8 U3.8), DSP_Power (C9.1 C10.2 C11.2 FB2.2)
+A5.0V: Audio_ADC (9 pins), DSP_Power (C50.1 C51.2 C52.2 FB4.2)
+D1.8V: TMS320F28335_DSP (13 pins), DSP_Power (15 pins)
+D3.3V: TMS320F28335_DSP (21 pins), DSP_Board_Headers (P7.1 P7.2 P7.3 P7.4), DSP_Power (17 pins)
+D5.0V: DSP_Board_Headers (5 pins), DSP_Power (8 pins)
ADCINA4: TMS320F28335_DSP (20 pins), Audio_ADC (8 pins), DSP_Board_Headers (10 pins), DSP_Power (10 pins)
GND: TMS320F28335_DSP (38 pins), Audio_ADC (C40.2), DSP_Board_Headers (5 pins), DSP_Power (33 pins)
ADCINA0: TMS320F28335_DSP (U1.42), DSP_Board_Headers (C46.2 R42.2)
ADCINA1: TMS320F28335_DSP (U1.41), DSP_Board_Headers (C47.2 R43.2)
ADCINA2: TMS320F28335_DSP (U1.40), DSP_Board_Headers (C48.2 R44.2)
ADCINA3: TMS320F28335_DSP (U1.39), DSP_Board_Headers (C49.2 R45.2)
ADS_CSN: TMS320F28335_DSP (U1.73), Audio_ADC (*.5)
ADS_DCLK: TMS320F28335_DSP (U1.72), Audio_ADC (*.7)
ADS_DOUT: TMS320F28335_DSP (U1.69), Audio_ADC (*.6)
LED_ENABLE: TMS320F28335_DSP (U1.6), DSP_Board_Headers (P2.2)
LOCK_ENABLE: TMS320F28335_DSP (U1.10), DSP_Board_Headers (P1.2)
PWM_FAN: TMS320F28335_DSP (U1.5), DSP_Board_Headers (P2.1)
PWM_PUMP: TMS320F28335_DSP (U1.7), DSP_Board_Headers (P5.2)
UART_RXD: TMS320F28335_DSP (U1.67), DSP_Board_Headers (P3.2)
UART_TXD: TMS320F28335_DSP (U1.66), DSP_Board_Headers (P3.1)
XRSn: TMS320F28335_DSP (U1.80), DSP_Power (R2.1 U7.18)